# Altium schematic sheet Модуль STM32F108CBT6.SchDoc
size 420 x 297 mm; SheetNumber: 1; SheetTotal: 1
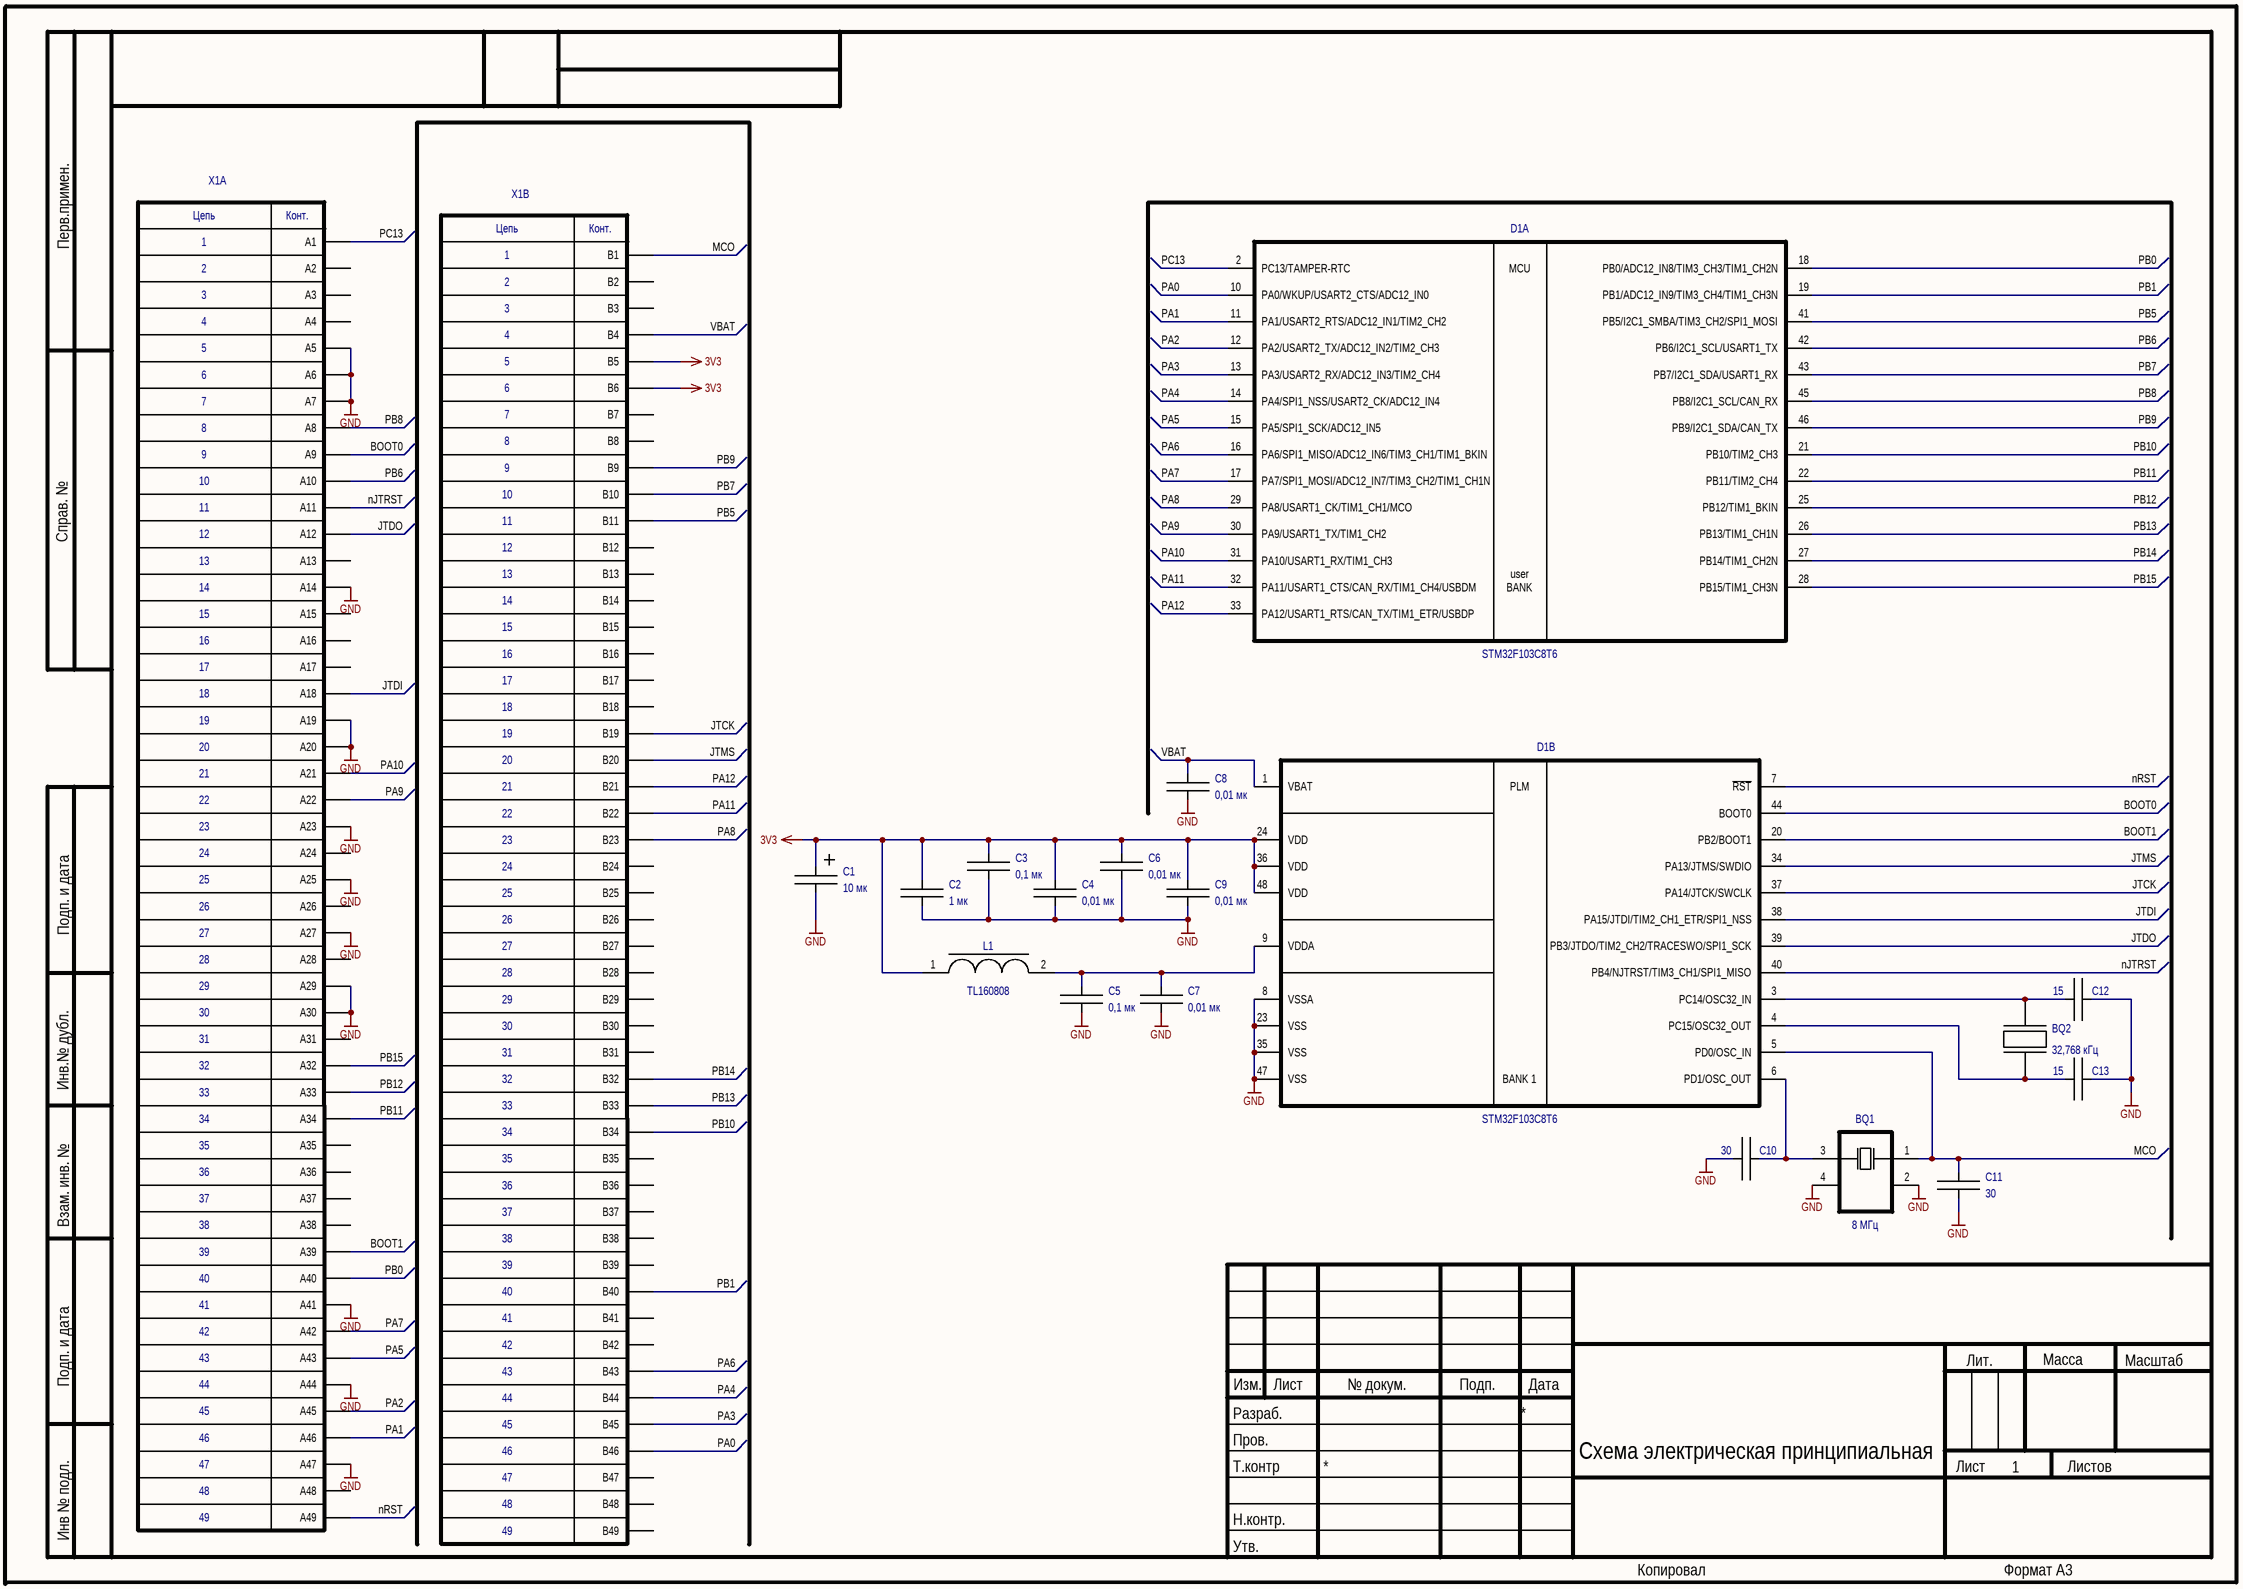
[diagram p0: Модуль STM32F108CBT6.SchDoc]

## Parts
BQ1  value 8 МГц  [SMD3225_4P20MHZ20PF10PPM]  (hidden comment: кварцевый резонатор_1)
BQ2  value 32,768 кГц  [SMD3215_2P32768KHZ125PF10PPM]  (hidden comment: 3215)
C1  value 10 мк  [K53-68_3216(A)]  (hidden comment: A-case)
C2  value 1 мк  [K10-69B_2.0_1.25(0805)]  (hidden comment: 0805)
C3  value 0,1 мк  [K10-79_1.6_0.8(0603)]  (hidden comment: 0603)
C4  value 0,01 мк  [K10-79_1.6_0.8(0603)]  (hidden comment: 0603)
C5  value 0,1 мк  [K10-79_1.6_0.8(0603)]  (hidden comment: 0603)
C6  value 0,01 мк  [K10-79_1.6_0.8(0603)]  (hidden comment: 0603)
C7  value 0,01 мк  [K10-79_1.6_0.8(0603)]  (hidden comment: 0603)
C8  value 0,01 мк  [K10-79_1.6_0.8(0603)]  (hidden comment: 0603)
C9  value 0,01 мк  [K10-79_1.6_0.8(0603)]  (hidden comment: 0603)
C10  value 30  [K10-79_1.6_0.8(0603)]  (hidden comment: 0603)
C11  value 30  [K10-79_1.6_0.8(0603)]  (hidden comment: 0603)
C12  value 15  [K10-79_1.6_0.8(0603)]  (hidden comment: 0603)
C13  value 15  [K10-79_1.6_0.8(0603)]  (hidden comment: 0603)
D1  value STM32F103C8T6  [LQFP48]  (parts A,B of 2)
L1  value TL160808  [742792651]  (hidden comment: 0603)
X1  KONT_POLE_MEZ  [3113-112t_otv]  (value not drawn)  (parts A,B of 2)

## Nets
3V3: C1.1 C2.2 C3.2 C4.2 C6.2 C9.2 D1.24(VDD) D1.36(VDD) D1.48(VDD) L1.1 X1.B5 X1.B6
GND: BQ1.2(GND) BQ1.4(GND) C1.2 C2.1 C3.1 C4.1 C5.1 C6.1 C7.1 C8.1 C9.1 C10.1 C11.1 C12.1 C13.1 D1.8(VSSA) D1.23(VSS) D1.35(VSS) D1.47(VSS) X1.A5 X1.A6 X1.A7 X1.A14 X1.A19 X1.A20 X1.A23 X1.A25 X1.A27 X1.A29 X1.A30 X1.A41 X1.A44 X1.A47
BOOT0: D1.44(BOOT0) X1.A9
BOOT1: D1.20(PB2/BOOT1) X1.A39
JTCK: D1.37(PA14/JTCK/SWCLK) X1.B19
JTDI: D1.38(PA15/JTDI/TIM2_CH1_ETR/SPI1_NSS) X1.A18
JTDO: D1.39(PB3/JTDO/TIM2_CH2/TRACESWO/SPI1_SCK) X1.A12
JTMS: D1.34(PA13/JTMS/SWDIO) X1.B20
MCO: BQ1.1 C11.2 D1.5(PD0/OSC_IN) X1.B1
nJTRST: D1.40(PB4/NJTRST/TIM3_CH1/SPI1_MISO) X1.A11
nRST: D1.7(~{RST}) X1.A49
PA0: D1.10(PA0/WKUP/USART2_CTS/ADC12_IN0) X1.B46
PA1: D1.11(PA1/USART2_RTS/ADC12_IN1/TIM2_CH2) X1.A46
PA2: D1.12(PA2/USART2_TX/ADC12_IN2/TIM2_CH3) X1.A45
PA3: D1.13(PA3/USART2_RX/ADC12_IN3/TIM2_CH4) X1.B45
PA4: D1.14(PA4/SPI1_NSS/USART2_CK/ADC12_IN4) X1.B44
PA5: D1.15(PA5/SPI1_SCK/ADC12_IN5) X1.A43
PA6: D1.16(PA6/SPI1_MISO/ADC12_IN6/TIM3_CH1/TIM1_BKIN) X1.B43
PA7: D1.17(PA7/SPI1_MOSI/ADC12_IN7/TIM3_CH2/TIM1_CH1N) X1.A42
PA8: D1.29(PA8/USART1_CK/TIM1_CH1/MCO) X1.B23
PA9: D1.30(PA9/USART1_TX/TIM1_CH2) X1.A22
PA10: D1.31(PA10/USART1_RX/TIM1_CH3) X1.A21
PA11: D1.32(PA11/USART1_CTS/CAN_RX/TIM1_CH4/USBDM) X1.B22
PA12: D1.33(PA12/USART1_RTS/CAN_TX/TIM1_ETR/USBDP) X1.B21
PB0: D1.18(PB0/ADC12_IN8/TIM3_CH3/TIM1_CH2N) X1.A40
PB1: D1.19(PB1/ADC12_IN9/TIM3_CH4/TIM1_CH3N) X1.B40
PB5: D1.41(PB5/I2C1_SMBA/TIM3_CH2/SPI1_MOSI) X1.B11
PB6: D1.42(PB6/I2C1_SCL/USART1_TX) X1.A10
PB7: D1.43(PB7/I2C1_SDA/USART1_RX) X1.B10
PB8: D1.45(PB8/I2C1_SCL/CAN_RX) X1.A8
PB9: D1.46(PB9/I2C1_SDA/CAN_TX) X1.B9
PB10: D1.21(PB10/TIM2_CH3) X1.B34
PB11: D1.22(PB11/TIM2_CH4) X1.A34
PB12: D1.25(PB12/TIM1_BKIN) X1.A33
PB13: D1.26(PB13/TIM1_CH1N) X1.B33
PB14: D1.27(PB14/TIM1_CH2N) X1.B32
PB15: D1.28(PB15/TIM1_CH3N) X1.A32
PC13: D1.2(PC13/TAMPER-RTC) X1.A1
VBAT: C8.2 D1.1(VBAT) X1.B4
NetBQ1_3: BQ1.3 C10.2 D1.6(PD1/OSC_OUT)
NetBQ2_1: BQ2.1(IN) C12.2 D1.3(PC14/OSC32_IN)
NetBQ2_2: BQ2.2(GND) C13.2 D1.4(PC15/OSC32_OUT)
NetC5_2: C5.2 C7.2 D1.9(VDDA) L1.2

Not connected (* = marked no-connect by the designer): X1 A2 A3 A4 A13 A15 A16 A17 A24 A26 A28 A31 A35 A36 A37 A38 A48 B2 B3 B7 B8 B12 B13 B14 B15 B16 B17 B18 B24 B25 B26 B27 B28 B29 B30 B31 B35 B36 B37 B38 B39 B41 B42 B47 B48 B49

## Notes on the sheet
- Перв.примен.
- Справ. №
- Подп. и дата
- Инв.№ дубл.
- Взам. инв. №
- Изм.
- Лист
- № докум.
- Подп.
- Дата
- Лит.
- Масса
- Масштаб
- Пров.
- Т.контр
- Разраб.
- Схема электрическая принципиальная
- 1
- Листов
- Инв № подл.
- Н.контр.
- Утв.
- Копировал
- Формат А3
- (in symbol 3113-112T, part A) Цепь; Конт.; 1; 2; 3; 4; 5; 6; 7; 8; 9; 10; 11; 12; 13; 14; 15; 16; 17; 18; 19; 20; 21; 22; 23; 24; 25; 26; 27; 28; 29; 30; 31; 32; 33; 34; 35; 36; 37; 38; 39; 40; 41; 42; 43; 44; 45; 46; 47; 48; 49
- (in symbol 3113-112T, part B) Цепь; Конт.; 1; 2; 3; 4; 5; 6; 7; 8; 9; 10; 11; 12; 13; 14; 15; 16; 17; 18; 19; 20; 21; 22; 23; 24; 25; 26; 27; 28; 29; 30; 31; 32; 33; 34; 35; 36; 37; 38; 39; 40; 41; 42; 43; 44; 45; 46; 47; 48; 49
- (in symbol stm32f103c8t6, part A) MCU; user; BANK
- (in symbol stm32f103c8t6, part B) PLM; BANK 1

## Library data of the parts
BQ1 = кварцевый резонатор_1: PartNumber: MQ-12.000-18; Company: Mercury; Package: 0705
BQ2 = кварцевый резонатор: PartNumber: 32,768 кГц 3215 SMD; Company: Mercury; Package: 3215
C1 = C+: Company: *; Tolerance: *; Voltage: *; Type: *; PartNumber: *; Package: A-case
C2-C13 = C: Company: *; PartNumber: *; Tolerance: *; Voltage: *; Type: *
  C2: Package: 0805
  C3-C13: Package: 0603
D1 = stm32f103c8t6: Company: Xilinx; PurtNamber: XC6SLX25-2FGG484C; Package: LQFP-48
L1 = SH6028-5R0YLB: Company: ABC Electronics Group; CurrentMax: 2,4А; PartNumber: TL160808; Package: 0603
X1 = 3113-112T